# EAGLE design WIMOS-motherboard (EAGLE 7.3.0)
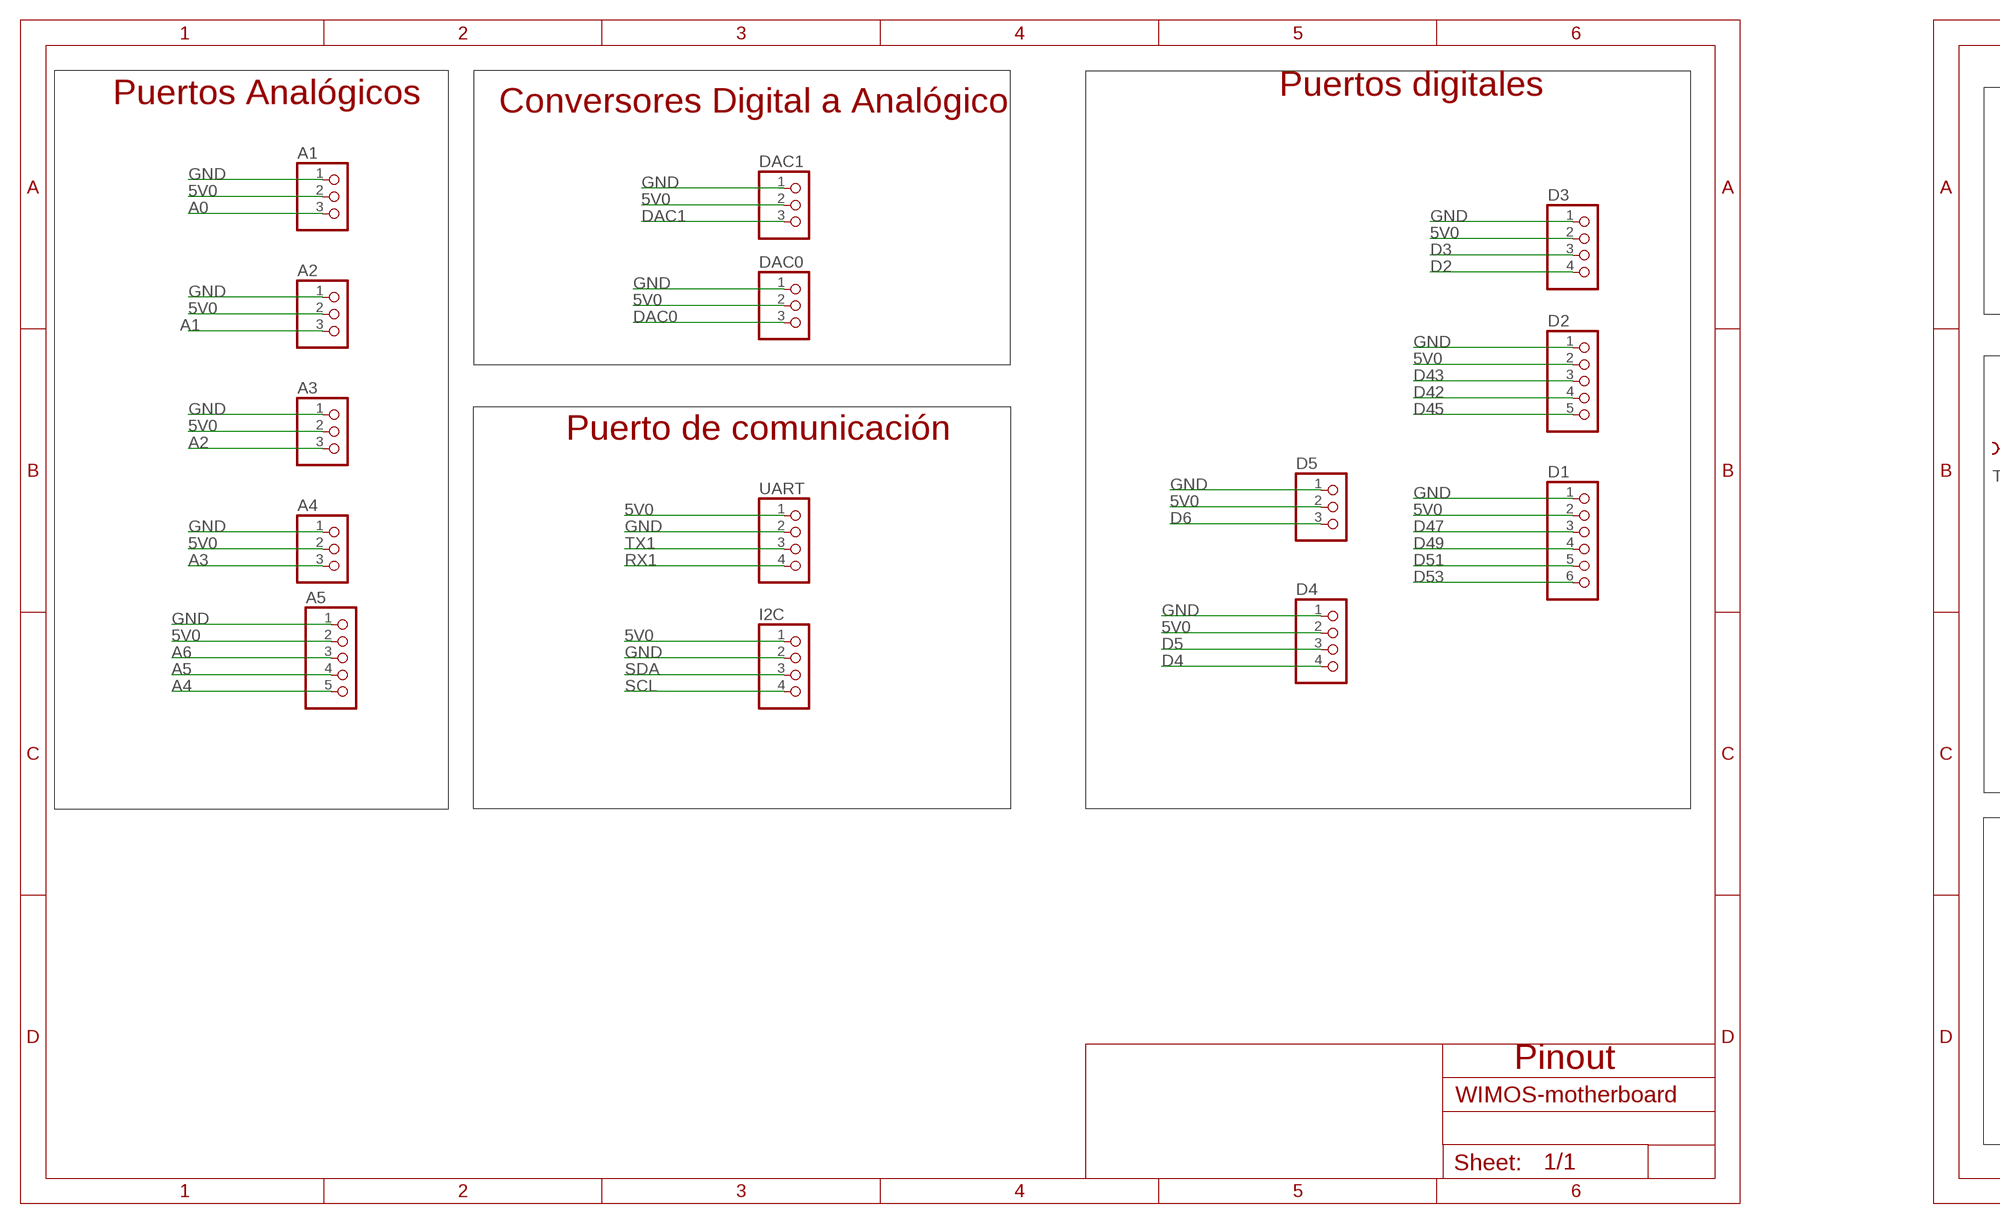
[diagram p0: schematic, sheet 1, part 1 of 2]
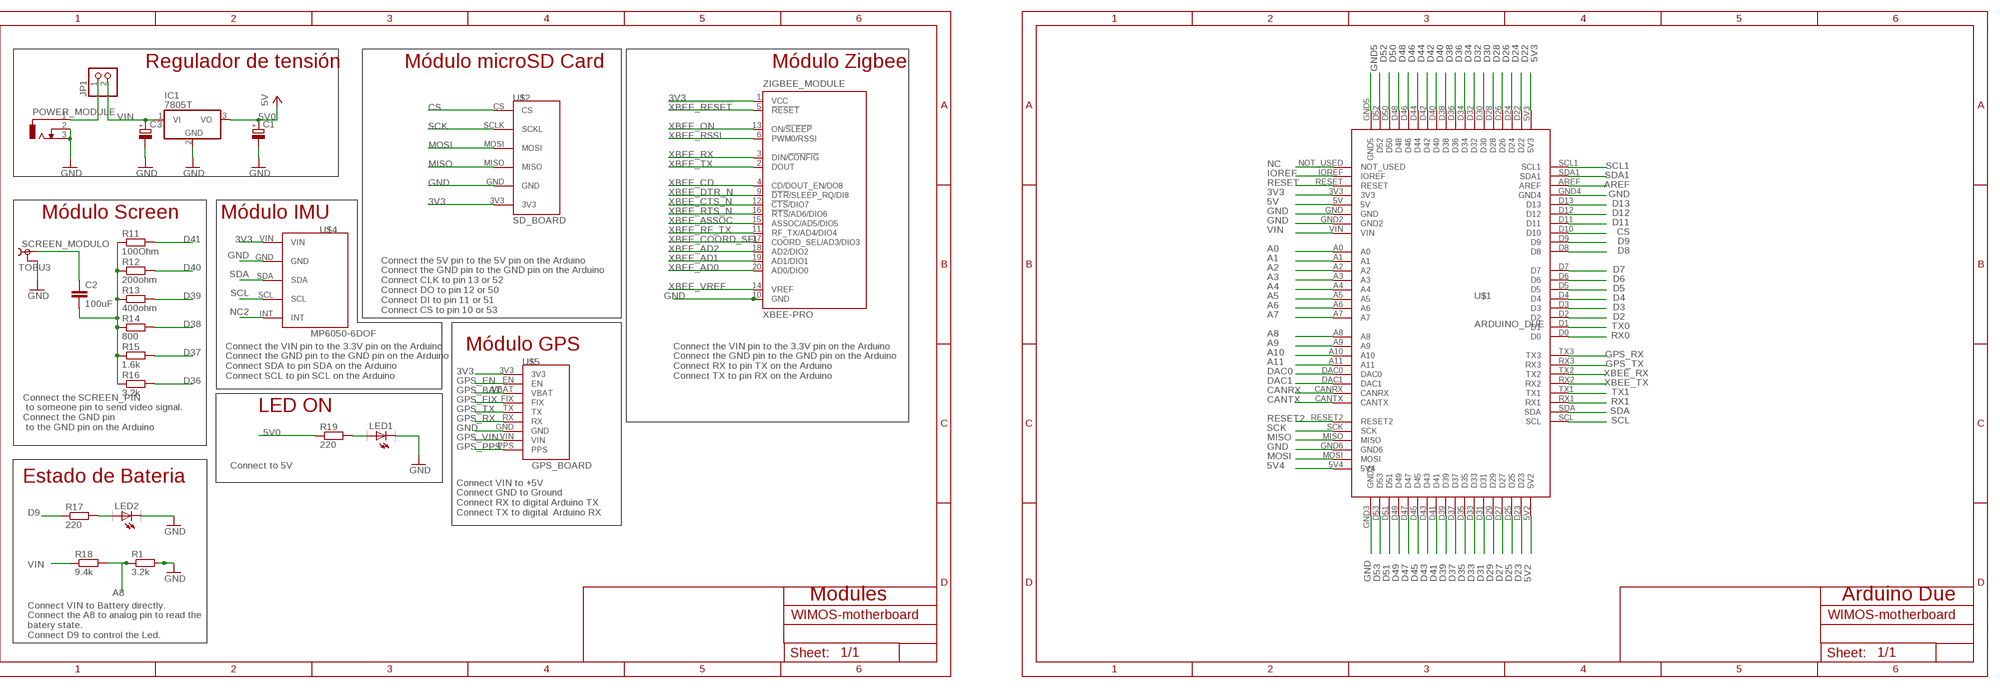
[diagram p1: schematic, sheet 1, part 2 of 2]

## Parts
A1  PINHD-1X3/90  [1X03/90]
A2  PINHD-1X3/90  [1X03/90]
A3  PINHD-1X3/90  [1X03/90]
A4  PINHD-1X3/90  [1X03/90]
A5  PINHD-1X5/90  [1X05/90]
C1  CPOL-EU153CLV-0810  [153CLV-0810]
C2  100uF  C-EU025-025X050  [C025-025X050]
C3  CPOL-EU153CLV-0810  [153CLV-0810]
D1  PINHD-1X6/90  [1X06/90]
D2  PINHD-1X5/90  [1X05/90]
D3  PINHD-1X4/90  [1X04/90]
D4  PINHD-1X4/90  [1X04/90]
D5  PINHD-1X3/90  [1X03/90]
DAC0  PINHD-1X3/90  [1X03/90]
DAC1  PINHD-1X3/90  [1X03/90]
I2C  PINHD-1X4/90  [1X04/90]
IC1  7805T  [TO220H]
JP1  PINHD-1X2  [1X02]
LED1  LED_E  [LED_1206]
LED2  LED_E  [LED_1206]
POWER_MODULE  DCJ0303  [DCJ0303]
R1  3.2k  R-EU_R0805  [R0805]
R11  100Ohm  R-EU_R0805  [R0805]
R12  200ohm  R-EU_R0805  [R0805]
R13  400ohm  R-EU_R0805  [R0805]
R14  800  R-EU_R0805  [R0805]
R15  1.6k  R-EU_R0805  [R0805]
R16  3.2k  R-EU_R0805  [R0805]
R17  220  R-EU_R0805  [R0805]
R18  9.4k  R-EU_R0805  [R0805]
R19  220  R-EU_R0805  [R0805]
SCREEN_MODULO  TOBU3  [TOBU3]
U$1  ARDUINO_DUE  [ARDUINO_DUE]
U$2  SD_BOARD  [SD_BOARD]
U$4  MP6050-6DOF  [MP6050-6DOF]
U$5  GPS_BOARD  [SD_BOARD]
UART  PINHD-1X4/90  [1X04/90]
ZIGBEE_MODULE  XBEE-PRO  [XBEE-PRO]

## Nets
3V3: U$1.3V3 U$2.3V3 U$4.VIN U$5.3V3 ZIGBEE_MODULE.1(VCC)
5V: U$1.5V
5V0: A1.2 A2.2 A3.2 A4.2 A5.2 C1.+ D1.2 D2.2 D3.2 D4.2 D5.2 DAC0.2 DAC1.2 I2C.1 IC1.3(VO) R19.1 UART.1 ; supply symbol labelled 5V
5V2: U$1.5V2
5V3: U$1.5V3
5V4: U$1.5V4
!XBEE_RESET: ZIGBEE_MODULE.5(!RESET)
A0: A1.3 U$1.A0
A1: A2.3 U$1.A1
A2: A3.3 U$1.A2
A3: A4.3 U$1.A3
A4: A5.5 U$1.A4
A5: A5.4 U$1.A5
A6: A5.3 U$1.A6
A7: U$1.A7
A8: R1.1 R18.2 U$1.A8
A9: U$1.A9
A10: U$1.A10
A11: U$1.A11
AREF: U$1.AREF
CANRX: U$1.CANRX
CANTX: U$1.CANTX
CS: U$1.D10 U$2.CS
D2: D3.4 U$1.D2
D3: D3.3 U$1.D3
D4: D4.4 U$1.D4
D5: D4.3 U$1.D5
D6: D5.3 U$1.D6
D7: U$1.D7
D8: U$1.D8
D9: R17.1 U$1.D9
D11: U$1.D11
D12: U$1.D12
D13: U$1.D13
D22: U$1.D22
D23: U$1.D23
D24: U$1.D24
D25: U$1.D25
D26: U$1.D26
D27: U$1.D27
D28: U$1.D28
D29: U$1.D29
D30: U$1.D30
D31: U$1.D31
D32: U$1.D32
D33: U$1.D33
D34: U$1.D34
D35: U$1.D35
D36: R16.2 U$1.D36
D37: R15.2 U$1.D37
D38: R14.2 U$1.D38
D39: R13.2 U$1.D39
D40: R12.2 U$1.D40
D41: R11.2 U$1.D41
D42: D2.4 U$1.D42
D43: D2.3 U$1.D43
D44: U$1.D44
D45: D2.5 U$1.D45
D46: U$1.D46
D47: D1.3 U$1.D47
D48: U$1.D48
D49: D1.4 U$1.D49
D50: U$1.D50
D51: D1.5 U$1.D51
D52: U$1.D52
D53: D1.6 U$1.D53
DAC0: DAC0.3 U$1.DAC0
DAC1: DAC1.3 U$1.DAC1
GND [gnd]: A1.1 A2.1 A3.1 A4.1 A5.1 C1.- C3.- D1.1 D2.1 D3.1 D4.1 D5.1 DAC0.1 DAC1.1 I2C.2 IC1.2(GND) LED1.C LED2.C POWER_MODULE.2 POWER_MODULE.3 R1.2 SCREEN_MODULO.2 SCREEN_MODULO.2@1 SCREEN_MODULO.2@2 U$1.GND U$1.GND2 U$1.GND3 U$1.GND4 U$1.GND6 U$2.GND U$4.GND U$5.GND UART.2 ZIGBEE_MODULE.10(GND)
GND5: U$1.GND5
GPS_BAT: U$5.VBAT
GPS_EN: U$5.EN
GPS_FIX: U$5.FIX
GPS_PPS: U$5.PPS
GPS_RX: U$1.TX3 U$5.RX
GPS_TX: U$1.RX3 U$5.TX
GPS_VIN: U$5.VIN
IOREF: U$1.IOREF
MISO: U$1.MISO U$2.MISO
MOSI: U$1.MOSI U$2.MOSI
N$1: LED1.A R19.2
N$2: C2.1 SCREEN_MODULO.1
N$3: JP1.1 POWER_MODULE.1
N$4: LED2.A R17.2
N$10: C2.2 R11.1 R12.1 R13.1 R14.1 R15.1 R16.1
NC: U$1.NOT_USED
NC2: U$4.INT
RESET: U$1.RESET
RESET2: U$1.RESET2
RX0: U$1.D0
RX1: U$1.RX1 UART.4
SCK: U$1.SCK U$2.SCLK(SCKL)
SCL: I2C.4 U$1.SCL U$4.SCL
SCL1: U$1.SCL1
SDA: I2C.3 U$1.SDA U$4.SDA
SDA1: U$1.SDA1
TX0: U$1.D1
TX1: U$1.TX1 UART.3
VIN: C3.+ IC1.1(VI) JP1.2 R18.1 U$1.VIN
XBEE_AD0: ZIGBEE_MODULE.20(AD0/DIO0)
XBEE_AD1: ZIGBEE_MODULE.19(AD1/DIO1)
XBEE_AD2: ZIGBEE_MODULE.18(AD2/DIO2)
XBEE_ASSOC: ZIGBEE_MODULE.15(ASSOC/AD5/DIO5)
XBEE_CD: ZIGBEE_MODULE.4(CD/DOUT_EN/DO8)
XBEE_COORD_SEL: ZIGBEE_MODULE.17(COORD_SEL/AD3/DIO3)
XBEE_CTS_N: ZIGBEE_MODULE.12(!CTS!/DIO7)
XBEE_DTR_N: ZIGBEE_MODULE.9(!DTR!/SLEEP_RQ/DI8)
XBEE_ON: ZIGBEE_MODULE.13(ON/!SLEEP)
XBEE_RF_TX: ZIGBEE_MODULE.11(RF_TX/AD4/DIO4)
XBEE_RSSI: ZIGBEE_MODULE.6(PWM0/RSSI)
XBEE_RTS_N: ZIGBEE_MODULE.16(!RTS!/AD6/DIO6)
XBEE_RX: U$1.TX2 ZIGBEE_MODULE.3(DIN/!CONFIG)
XBEE_TX: U$1.RX2 ZIGBEE_MODULE.2(DOUT)
XBEE_VREF: ZIGBEE_MODULE.14(VREF)

## Notes on the sheet
- Puertos Analógicos | Puertos digitales
- Conversores Digital a Analógico | Regulador de tensión | Módulo microSD Card | Módulo Zigbee
- Módulo Screen | Módulo IMU
- Puerto de comunicación
- Connect the 5V pin to the 5V pin on the Arduino
  Connect the GND pin to the GND pin on the Arduino
  Connect CLK to pin 13 or 52
  Connect DO to pin 12 or 50
  Connect DI to pin 11 or 51
  Connect CS to pin 10 or 53
- Módulo GPS
- Connect the VIN pin to the 3.3V pin on the Arduino
  Connect the GND pin to the GND pin on the Arduino
  Connect SDA to pin SDA on the Arduino
  Connect SCL to pin SCL on the Arduino
- Connect the VIN pin to the 3.3V pin on the Arduino
  Connect the GND pin to the GND pin on the Arduino
  Connect RX to pin TX on the Arduino
  Connect TX to pin RX on the Arduino
- LED ON
- Connect the SCREEN_PIN
   to someone pin to send video signal.
  Connect the GND pin
   to the GND pin on the Arduino
- Connect to 5V
- Estado de Bateria
- Connect VIN to +5V
  Connect GND to Ground
  Connect RX to digital Arduino TX
  Connect TX to digital  Arduino RX
- Pinout | Modules | Arduino Due
- Connect VIN to Battery directly.
  Connect the A8 to analog pin to read the 
  batery state.
  Connect D9 to control the Led.

## Library data of the parts
A1-A4 D5 DAC0 DAC1 = pinhead:PINHD-1X3: PIN HEADER
A5 D2 = pinhead:PINHD-1X5: PIN HEADER
C1 C3 = rcl:CPOL-EU: POLARIZED CAPACITOR, European symbol
C2 = rcl:C-EU: CAPACITOR, European symbol
D1 = pinhead:PINHD-1X6: PIN HEADER
D3 D4 I2C UART = pinhead:PINHD-1X4: PIN HEADER
IC1 = linear:78*: Positive VOLTAGE REGULATOR Source: http://cache.national.com/ds/LM/LM78L05.pdf http://www.fairchildsemi.com/ds/LM/LM7805.pdf
JP1 = pinhead:PINHD-1X2: PIN HEADER
LED1 LED2 = eagle-ltspice:LED_E: LED Source: http://www.osram.convergy.de Source: www.luxeon.com Source: www.kingbright.com; SPICEMODEL: NONE; SPICEPREFIX: D; SPICETYPE: diode
POWER_MODULE = con-jack:DCJ0303: DC POWER JACK Source: DCJ0303.pdf; OC_FARNELL: unknown; OC_NEWARK: unknown
R1 R11-R19 = rcl:R-EU_: RESISTOR, European symbol
SCREEN_MODULO = con-hirschmann:TOBU3: Female Cinch CONNECTOR ( RCA Jack ); MF: FARNELL; MPN: TOBU 3; OC_FARNELL: 592791; OC_NEWARK: 06WX5914
U$1 = ArduinoDue:ARDUINO_DUE
U$2 = SdBoard:SD_BOARD
U$4 = mp6050:MP6050-6DOF
U$5 = GpsBoard:GPS_BOARD
ZIGBEE_MODULE = maxstream:XBEE: XBee (TM) /XBee-PRO(TM) OEM RF Modules Source: MaxStream, Inc. xbee_productmanual.pdf; MPN: XBP24-AWI-001; OC_FARNELL: 1337916; OC_NEWARK: 42M2667

## Module INPUT
Ports: 

### Library data of the parts

## Net classes
0 default: width 0.203 mm, drill 0.406 mm, clearance 0.203 mm
1 USB: width 0.203 mm, drill 0.406 mm, clearance 0.203 mm
2 gnd: width 0.203 mm, drill 0.406 mm, clearance 0.203 mm
3 usbvcc: width 0.203 mm, drill 0.406 mm, clearance 0.203 mm
4 USBpair: width 0.254 mm, drill 0.406 mm, clearance 0.61 mm

## Board
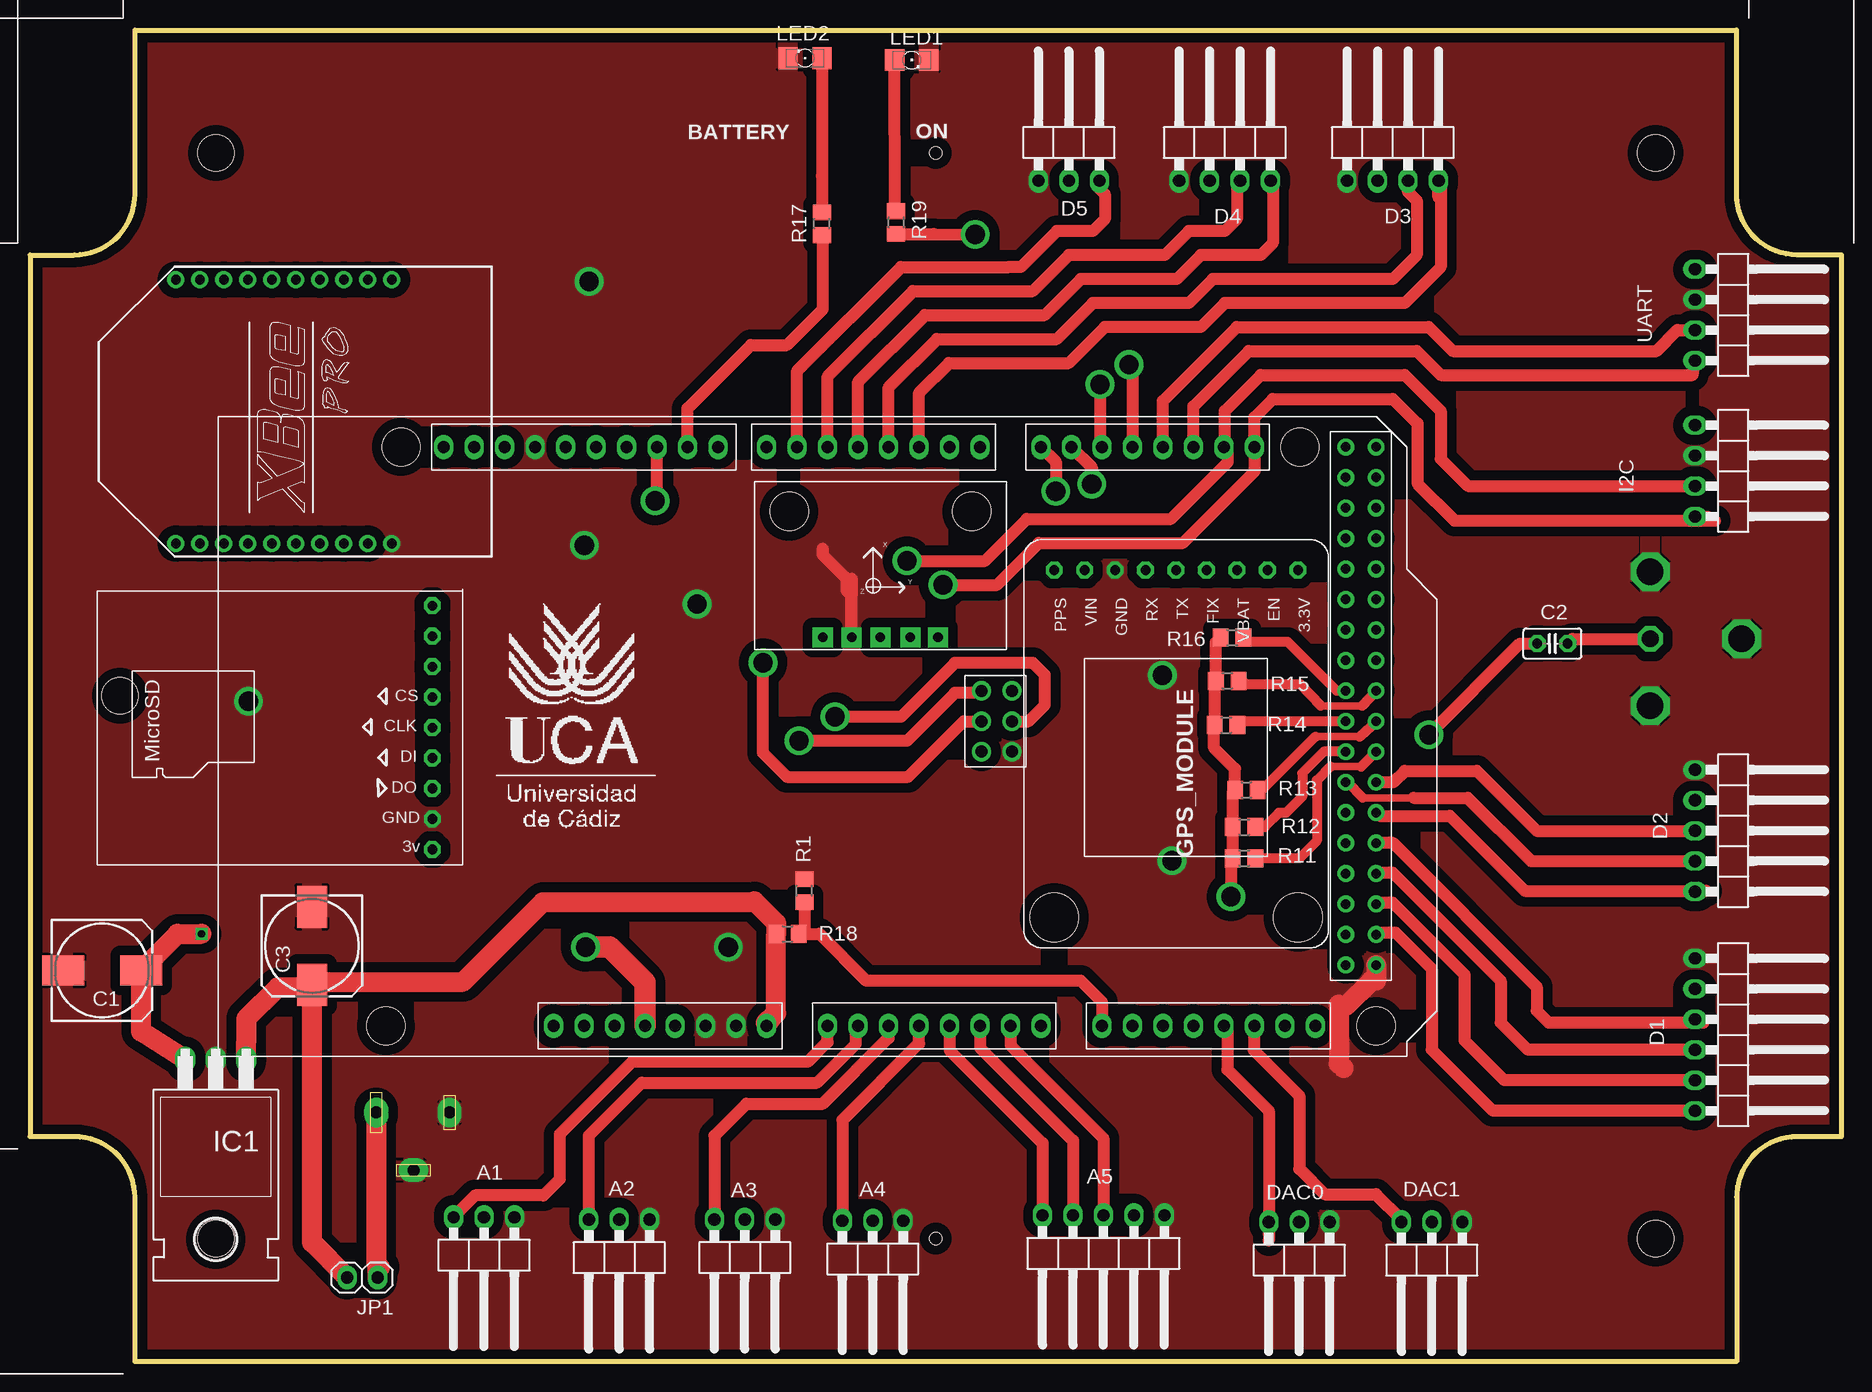
[diagram p2: board, top side]
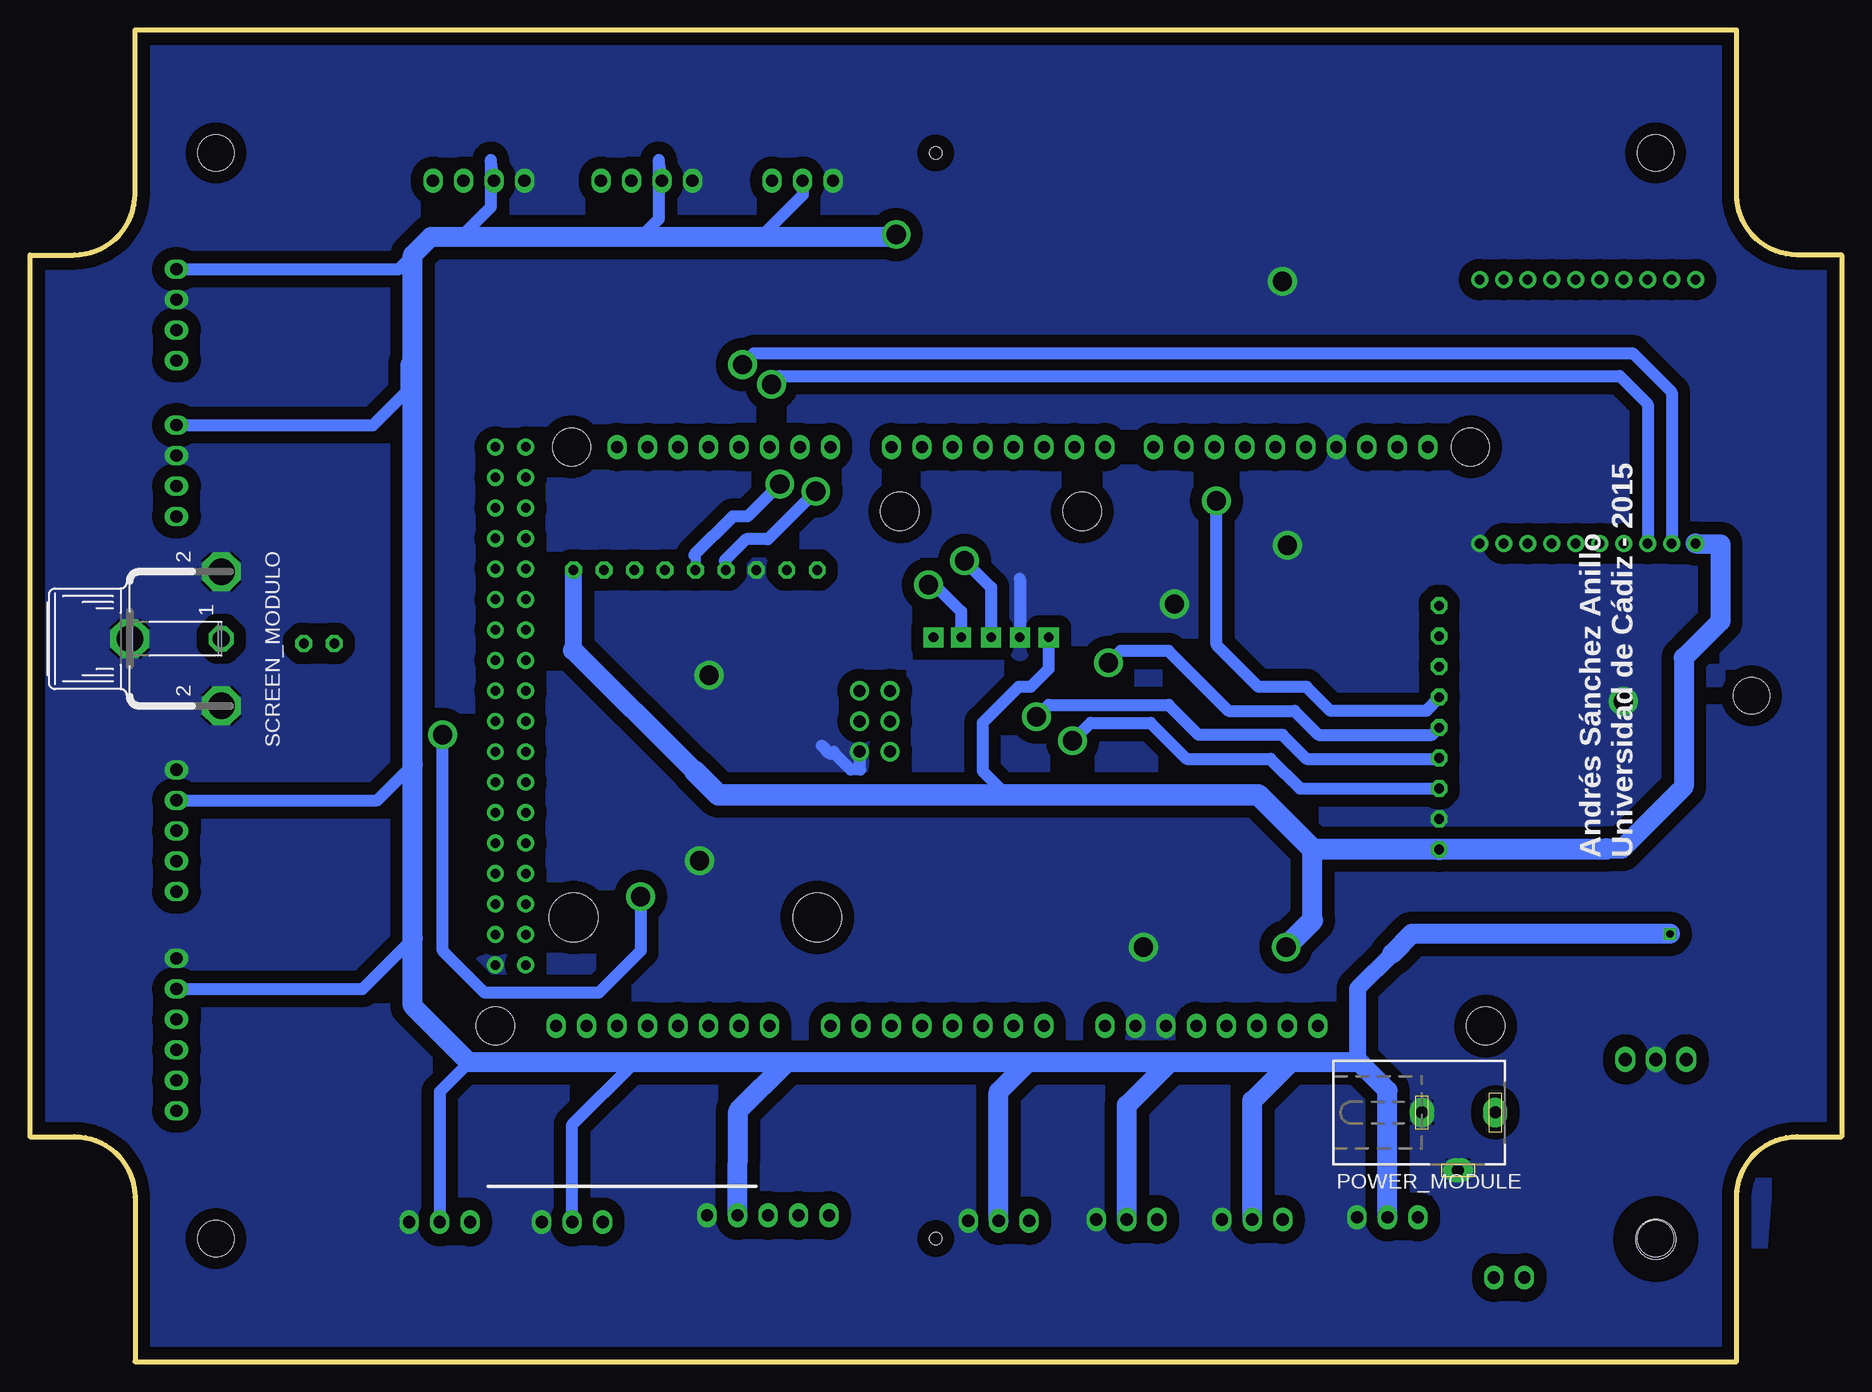
[diagram p3: board, bottom side, seen from below]

Size 151 x 111 mm. Coordinates in mm from the lower left corner, seen from the top.
Outline: 0,92.25 0,18.75 3.69,18.75 arc-90 8.75,13.69 8.75,0 142.25,0 142.25,13.69 arc-90 147.31,18.75 151,18.75 151,92.25 147.31,92.25 arc-90 142.25,97.31 142.25,111 8.75,111 8.75,97.31 arc-90 3.69,92.25 0,92.25
Copper layers (1*16): Top 0.035mm / dielectric 1.6mm / Bottom 0.035mm
Design rules "default *": minimum track width 8mil, minimum drill 16mil, track to track 8mil, track to pad 8mil, pad to pad 8mil, via to via 8mil, smd to smd 6mil, copper to edge 20mil, drill to drill 12mil, minimum pad ring 12mil, minimum via ring 8mil, stop-mask expansion 2mil, vias tented up to drill 25mil, thermal gap 8mil
Holes 3 mm at 7.5,55.5 15.5,100.75 135.5,100.75 15.5,10.25 135.5,10.25
Holes 1 mm at 75.5,100.75 75.5,10.25

### Footprints (pad centres in the part's own frame; a part is rotated, then mirrored left to right if it is on the bottom)
1X03/90 = drill 1.016 long: 1 -2.54,-3.81; 2 0,-3.81; 3 2.54,-3.81
1X05/90 = drill 1.016 long: 1 -5.08,-3.81; 2 -2.54,-3.81; 3 0,-3.81; 4 2.54,-3.81; 5 5.08,-3.81
153CLV-0810 = smd 3.5 x 2.5: + 3.25,0; - -3.25,0
C025-025X050 = drill 0.813 octagon: 1 -1.27,0; 2 1.27,0
1X06/90 = drill 1.016 long: 1 -6.35,-3.81; 2 -3.81,-3.81; 3 -1.27,-3.81; 4 1.27,-3.81; 5 3.81,-3.81; 6 6.35,-3.81
1X04/90 = drill 1.016 long: 1 -3.81,-3.81; 2 -1.27,-3.81; 3 1.27,-3.81; 4 3.81,-3.81
TO220H = drill 1.118 long: 1 -2.54,-10.16; 2 0,-10.16; 3 2.54,-10.16 | hole 3.302: 0,4.826
1X02 = drill 1.016 long: 1 -1.27,0; 2 1.27,0
LED_1206 = smd 1.6 x 1.803: A -1.422,0; C 1.422,0
DCJ0303 = drill 1 pad 2 long: 1 0,3.1; 2 4.8,0; 3 0,-3
R0805 = smd 1.3 x 1.5: 1 -0.95,0; 2 0.95,0
TOBU3 = drill 1.397 octagon: 1 0,-2.54 | drill 2.21 octagon: 2 5.588,-2.54; 2@1 -5.588,-2.54; 2@2 0,5.08
ARDUINO_DUE = drill 1 long: 3V3 -8.89,45.72; 5V -8.89,43.18; A0 -8.89,30.48; A1 -8.89,27.94; A2 -8.89,25.4; A3 -8.89,22.86; A4 -8.89,20.32; A5 -8.89,17.78; A6 -8.89,15.24; A7 -8.89,12.7; A8 -8.89,7.62; A9 -8.89,5.08; A10 -8.89,2.54; A11 -8.89,0; AREF 39.37,57.404; CANRX -8.89,-7.62; CANTX -8.89,-10.16; D0 39.37,17.78; D1 39.37,20.32; D2 39.37,22.86; D3 39.37,25.4; D4 39.37,27.94; D5 39.37,30.48; D6 39.37,33.02; D7 39.37,35.56; D8 39.37,39.624; D9 39.37,42.164; D10 39.37,44.704; D11 39.37,47.244; D12 39.37,49.784; D13 39.37,52.324; DAC0 -8.89,-2.54; DAC1 -8.89,-5.08; GND -8.89,40.64; GND2 -8.89,38.1; GND4 39.37,54.864; IOREF -8.89,50.8; NOT_USED -8.89,53.34; RESET -8.89,48.26; RX1 39.37,0; RX2 39.37,5.08; RX3 39.37,10.16; SCL 39.37,-5.08; SCL1 39.37,62.484; SDA 39.37,-2.54; SDA1 39.37,59.944; TX1 39.37,2.54; TX2 39.37,7.62; TX3 39.37,12.7; VIN -8.89,35.56 | drill 0.8: 5V2 39.37,-15.24; 5V3 39.37,-12.7; D22 36.83,-12.7; D23 36.83,-15.24; D24 34.29,-12.7; D25 34.29,-15.24; D26 31.75,-12.7; D27 31.75,-15.24; D28 29.21,-12.7; D29 29.21,-15.24; D30 26.67,-12.7; D31 26.67,-15.24; D32 24.13,-12.7; D33 24.13,-15.24; D34 21.59,-12.7; D35 21.59,-15.24; D36 19.05,-12.7; D37 19.05,-15.24; D38 16.51,-12.7; D39 16.51,-15.24; D40 13.97,-12.7; D41 13.97,-15.24; D42 11.43,-12.7; D43 11.43,-15.24; D44 8.89,-12.7; D45 8.89,-15.24; D46 6.35,-12.7; D47 6.35,-15.24; D48 3.81,-12.7; D49 3.81,-15.24; D50 1.27,-12.7; D51 1.27,-15.24; D52 -1.27,-12.7; D53 -1.27,-15.24; GND3 -3.81,-15.24; GND5 -3.81,-12.7 | drill 1: 5V4 19.05,15.113; GND6 13.97,15.113; MISO 19.05,17.653; MOSI 16.51,15.113; RESET2 13.97,17.653; SCK 16.51,17.653 | hole 3.175: 39.37,66.04; -8.89,67.31; -8.89,-15.24; 39.37,-8.89
SD_BOARD = drill 0.8 octagon: 3V3 27.94,-21.56; CD 27.94,-6.32; CD1 27.94,-3.78; CD2 27.94,-1.24; CS 27.94,-8.86; GND 27.94,-19.02; MISO 27.94,-16.48; MOSI 27.94,-13.94; SCLK 27.94,-11.4
MP6050-6DOF = drill 0.8 pad 1.676 square: GND 8.1,1; INT 15.3,1; SCL 13,1; SDA 10.5,1; VIN 5.7,1 | hole 3.2: 2.9,11.5; 18.1,11.5
SD_BOARD' = drill 0.8 octagon: 3V3 2.794,22.86; EN 2.794,20.32; FIX 2.794,15.24; GND 2.794,7.62; PPS 2.794,2.54; RX 2.794,10.16; TX 2.794,12.7; VBAT 2.794,17.78; VIN 2.794,5.08 | hole 4.064: 31.75,22.86; 31.75,2.54
XBEE-PRO = drill 0.8 pad 1.27: 1 -11,9; 2 -11,7; 3 -11,5; 4 -11,3; 5 -11,1; 6 -11,-1; 7 -11,-3; 8 -11,-5; 9 -11,-7; 10 -11,-9; 11 11,-9; 12 11,-7; 13 11,-5; 14 11,-3; 15 11,-1; 16 11,1; 17 11,3; 18 11,5; 19 11,7; 20 11,9

### Placement (x,y rotation side)
A1  37.84,8.22 180 top
A2  49.12,8.02 180 top
A3  59.58,8.02 180 top
A4  70.25,7.92 180 top
A5  89.48,8.37 180 top
C1  6,32.6 0 top
C2  126.9,59.85 180 top
C3  23.5,34.65 270 top
D1  142.6,27.25 270 top
D2  142.6,44.25 270 top
D3  113.6,102.25 0 top
D4  99.6,102.25 0 top
D5  86.6,102.25 0 top
DAC0  105.79,7.82 180 top
DAC1  116.85,7.82 180 top
I2C  142.6,74.25 270 top
IC1  15.48,15.02 180 top
JP1  27.7,7 180 top
LED1  73.5,108.5 0 top
LED2  64.6,108.65 180 top
POWER_MODULE  31.96,20.75 270 bottom
R1  64.55,39.25 90 top
R11  101.2,41.95 0 top
R12  101.2,44.55 0 top
R13  101.4,47.65 0 top
R14  99.7,53.05 0 top
R15  99.8,56.75 0 top
R16  100.2,60.35 0 top
R17  66,94.85 90 top
R18  63.15,35.65 0 top
R19  72.2,94.95 90 top
SCREEN_MODULO  137.6,60.25 90 bottom
U$1  96.97,36.86 90 top
U$2  5.6,64.25 0 top
U$4  60.38,59.36 0 top
U$5  GPS_BOARD  [SD_BOARD']  82.84,68.77 270 top
UART  142.6,87.25 270 top
ZIGBEE_MODULE  21.16,79.19 90 top

### Tracks (layer width: path | path; a pad name or v marks a point on that pad's centre or on a via)
3V3  (via drill 1.6 pad 1.68)
  Top 1.778: U$1.3V3 51.25,31.6 48.3,34.55 v46.3,34.55
  Bottom 1.016: 69.6,47.25 71.6,49.25 71.6,53.25 68.6,56.25 67.6,56.25 66.1,57.75 66.1,60.35 U$4.VIN
  Bottom 1.422: 105.75,59.3 105.7,59.35 U$5.3V3
  Bottom 1.676: 94.4,48.05 95.61,49.25 105.75,59.3 | 44.09,36.76 44.09,42.74 | ZIGBEE_MODULE.1 10.1,68.13 10.1,61.7 13.15,58.65 13.15,47.9 18.32,42.73 19.6,42.73
  Bottom 1.778: 19.6,42.73 U$2.3V3 44.09,42.74 48.6,47.25 69.6,47.25 93.61,47.25 95.61,49.25 | v46.3,34.55 44.09,36.76
5V0  (via drill 0.6, 1.6 pad 1.68)
  Top 1.016: R19.1 75.35,94 v78.8,93.95
  Top 1.676: IC1.3 9.25,27.52 C1.+ 12.3,35.65 v14.3,35.65
  Bottom 1.016: 114.4,24.95 116.85,22.5 DAC1.2 | DAC0.2 105.79,19.76 100.6,24.95 | D1.2 123.29,31.06 119.1,35.25 | I2C.1 122.41,78.06 119.6,80.87 119.6,82.25 | 119.6,82.25 119.6,83.25 | D3.2 112.6,100.17 112.6,96.25 115.1,93.75 | D4.2 98.6,100.17 98.6,95.25 100.1,93.75 | D5.2 86.6,97.25 90.1,93.75 90.6,93.75 | 119.1,92.25 119.1,82.75 119.6,82.25 | UART.1 120.29,91.06 117.6,93.75 | D2.2 122.06,46.79 119.1,49.75
  Bottom 1.422: 36.35,35.1 37.45,34 40.35,31.1 40.35,25.1 40.05,24.8
  Bottom 1.676: 45.9,24.95 40.2,24.95 40.05,24.8 37.84,22.59 A1.2 | 45.9,24.95 56,24.95 | 56,24.95 67.8,24.95 | 67.8,24.95 87.9,24.95 | 87.9,24.95 100.6,24.95 114.4,24.95 119.1,29.65 119.1,35.25 119.1,49.75 119.1,92.25 117.6,93.75 115.1,93.75 100.1,93.75 90.6,93.75 79,93.75 v78.8,93.95 | A5.2 91.97,20.88 87.9,24.95 | A4.2 70.25,22.5 67.8,24.95 | A3.2 59.58,21.37 56,24.95 | A2.2 49.12,21.73 45.9,24.95 | v14.3,35.65 35.8,35.65 37.45,34
A0
  Top 1.016: U$1.A0 66.49,26.64 64.85,25 50.2,25 44.15,18.95 44.15,15.2 42.8,13.85 37.1,13.85 35.3,12.05 A1.3
A1
  Top 1.016: U$1.A1 68.85,27.79 68.85,26.5 65.6,23.25 51,23.25 46.58,18.83 A2.3
A2
  Top 1.016: U$1.A2 71.57,26.97 66.1,21.5 59.71,21.5 57.04,18.83 A3.3
A3
  Top 1.016: U$1.A3 74.11,26.51 67.71,20.11 A4.3
A4
  Top 1.016: U$1.A4 76.65,25.95 84.4,18.2 A5.5
A5
  Top 1.016: U$1.A5 79.19,26.16 86.94,18.41 A5.4
A6
  Top 1.016: U$1.A6 81.73,26.37 89.48,18.62 A5.3
A8
  Top 1.016: U$1.A8 89.35,30 87.6,31.75 69.7,31.75 65.8,35.65 R18.2 64.55,36.1 R1.1
CS  (via drill 1.6 pad 1.68)
  Top 1.016: v52.1,71.75 52.27,71.92 U$1.D10
  Bottom 1.016: v52.1,71.75 52.1,59.75 48.6,56.25 44.6,56.25 42.6,54.25 34.6,54.25 33.46,55.39 U$2.CS
D2
  Top 1.016: U$1.D2 74.11,80.76 76.6,83.25 86.6,83.25 89.6,86.25 97.6,86.25 99.6,88.25 114.6,88.25 117.6,91.25 117.6,98.25 D3.4 117.41,97.06
D3
  Top 1.016: U$1.D3 71.57,81.22 75.6,85.25 85.6,85.25 88.6,88.25 96.6,88.25 98.6,90.25 113.6,90.25 115.6,92.25 115.6,96.79 114.87,97.52 D3.3
D4
  Top 1.016: U$1.D4 69.03,81.68 74.6,87.25 84.6,87.25 87.6,90.25 95.6,90.25 97.6,92.25 102.6,92.25 103.6,93.25 103.6,97.87 103.41,98.06 D4.4
D5
  Top 1.016: U$1.D5 66.49,82.14 73.6,89.25 83.6,89.25 86.6,92.25 94.6,92.25 96.6,94.25 99.6,94.25 100.6,95.25 100.6,98.17 D4.3 100.87,98.52
D6
  Top 1.016: U$1.D6 63.95,82.6 72.6,91.25 81.6,91.25 82.6,91.25 85.6,94.25 88.6,94.25 89.6,95.25 89.6,97.33 89.14,97.79 D5.3
D9
  Top 1.016: U$1.D9 54.81,79.46 60.1,84.75 63.1,84.75 66.1,87.75 66.1,93.8 R17.1
D36
  Top 0.813: U$1.D36 108.94,55.91 104.85,60 101.5,60 R16.2
D37
  Top 0.61: 111.05,54.65 107.6,54.65
  Top 0.813: U$1.D37 111.05,54.65 | 107.6,54.65 105.9,56.45 101.4,56.45 101.3,56.55 100.95,56.55 R15.2
D38
  Top 0.813: U$1.D38 100.97,53.37 R14.2
D39
  Top 0.61: 110.84,52.1 107.15,52.1
  Top 0.813: U$1.D39 110.84,52.1 | 107.15,52.1 102.7,47.65 R13.2
D40
  Top 0.813: U$1.D40 107.83,50.83 106.05,49.05 106.05,47.1 104.7,45.75 104.1,45.75 102.9,44.55 R12.2
D41
  Top 0.61: 110.98,49.6 108.4,49.6
  Top 0.813: U$1.D41 110.98,49.6 | 108.4,49.6 107.25,48.45 107.25,43.4 105.8,41.95 R11.2
D42
  Top 0.61: 111.1,47 115.35,47
  Top 0.813: U$1.D42 109.81,48.29 111.1,47
  Top 1.016: D2.4 125.14,41.71 119.85,47 115.35,47
D43
  Top 1.016: U$1.D43 113.64,48.29 114.6,49.25 120.6,49.25 125.6,44.25 D2.3
D45
  Top 1.016: U$1.D45 112.47,45.5 118.35,45.5 124.6,39.25 139.71,39.25 D2.5
D47
  Top 1.016: U$1.D47 113.64,43.21 125.6,31.25 125.6,29.25 126.6,28.25 139.52,28.25 D1.3
D49
  Top 1.016: U$1.D49 112.29,40.75 113.6,40.75 122.6,31.75 122.6,28.25 124.87,25.98 D1.4
D51
  Top 1.016: U$1.D51 112.33,38.25 113.6,38.25 119.6,32.25 119.6,26.75 122.91,23.44 D1.5
D53
  Top 1.016: U$1.D53 112.37,35.75 113.85,35.75 116.85,32.75 116.85,26 121.95,20.9 D1.6
DAC0
  Top 1.016: U$1.DAC0 99.8,27.69 99.8,24.35 103.25,20.9 103.25,10.62 | 103.25,10.62 103.25,10.1 | DAC0.3 103.25,10.62
DAC1
  Top 1.016: U$1.DAC1 102,27.92 102,25.95 105.8,22.15 105.8,16.05 107.9,13.95 112.2,13.95 114.31,11.84 DAC1.3
GND  (via drill 1.6 pad 1.68)
  Top 1.016: U$4.GND 68.48,63.87 | 68.48,65.25 68.48,63.87 | 68.48,63.87 68.1,64.25 68.1,65.25 66.1,67.25 66.1,67.75
  Top 1.676: U$1.GND3 112.21,31.76 112.2,31.75 111.8,31.75 109.7,29.65 109.2,29.65 109.1,29.75 109.1,24.85 109.5,24.45
  Bottom 1.016: 84.02,50.83 84.1,50.75 | U$1.GND6 81.86,49.41 81.8,49.35 82.6,49.35 83.9,50.65 84.3,50.65 85,51.35 | 68.48,65.25 U$4.GND 68.6,60.25
  other vias: 94.4,57.2 18.2,55.05 95.2,41.75 46.6,90.05 55.6,63.15 46.2,68.05 58.2,34.55
  pour Bottom (isolate 1.016): 7.81,-0.7 143.45,-1.05 143.95,17.7 150.95,17.5 151.75,92.7 143.75,93.9 142.8,112.05 7.71,111.9 7.26,93.96 -1.45,92.95 -0.8,17.25 6.41,17.09
  pour Top (isolate 0.813): -0.91,113.31 153.6,113 153.35,-3.1 -2.21,-3.29
GPS_RX  (via drill 1.6 pad 1.68)
  Top 1.016: U$1.TX3 85.5,75.01 v85.5,72.55
  Bottom 0.813: 93.1,66.75 93,66.65 U$5.RX
  Bottom 1.016: v85.5,72.55 89.5,68.55 91.3,68.55 93.1,66.75
GPS_TX  (via drill 1.6 pad 1.68)
  Top 1.016: U$1.RX3 88.5,74.55 v88.5,73.15
  Bottom 0.813: 95.64,67.21 95.54,67.11 U$5.TX
  Bottom 1.016: v88.5,73.15 91.2,70.45 92.4,70.45 95.64,67.21
MISO  (via drill 1.6 pad 1.68)
  Top 1.016: U$1.MISO 79.15,55.75 77.1,55.75 73.1,51.75 v64.1,51.75
  Bottom 1.016: v64.1,51.75 62.6,53.25 57.6,53.25 54.6,50.25 47.6,50.25 45.12,47.77 U$2.MISO
MOSI  (via drill 1.6 pad 1.68)
  Top 1.016: U$1.MOSI 83.22,53.37 84.6,54.75 84.6,57.25 83.6,58.25 77.1,58.25 72.6,53.75 v67.1,53.75
  Bottom 1.016: v67.1,53.75 66.1,54.75 56.1,54.75 53.6,52.25 46.6,52.25 44.6,50.25 33.6,50.25 U$2.MOSI
N$1
  Top 1.016: R19.2 72.1,96 LED1.A
N$2
  Top 1.016: C2.1 128.57,60.25 SCREEN_MODULO.1
N$3
  Top 1.676: POWER_MODULE.1 28.86,8.14 29.15,7.85 28.97,7.67 JP1.1
N$4
  Top 1.016: LED2.A 66,98.83 R17.2
N$10  (via drill 1.6 pad 1.68)
  Top 1.016: R16.1 98.85,59.95 R15.1 98.75,56.65 R14.1 98.7,53 98.7,51.15 100.45,49.4 R13.1 100.25,47.45 R12.1 R11.1 100.1,41.8 v100.1,38.75 | v116.6,52.25 124.2,59.85 C2.2
  Bottom 1.016: v116.6,52.25 116.6,34.25 113.1,30.75 103.6,30.75 100.1,34.25 v100.1,38.75
RX1
  Top 1.016: U$1.RX1 96.97,79.62 101.6,84.25 115.6,84.25 117.6,82.25 138.6,82.25 UART.4
SCK  (via drill 1.6 pad 1.68)
  Top 1.016: v61.1,58.25 61.1,50.75 63.1,48.75 73.19,48.75 77.82,53.37 U$1.SCK
  Bottom 1.016: v61.1,58.25 60.1,59.25 56.1,59.25 51.1,54.25 45.6,54.25 43.6,52.25 34.14,52.25 U$2.SCLK
SCL  (via drill 1.6 pad 1.68)
  Top 0.61: 101.88,76.23 U$1.SCL 102.05,76.2
  Top 1.016: v76.1,64.75 80.6,64.75 84.1,68.25 96.1,68.25 102.1,74.25 102.1,76.19 U$1.SCL 102.05,78.7 103.6,80.25 113.6,80.25 115.65,78.2 115.65,73.2 118.75,70.1 139.8,70.1 | 139.8,70.1 140.45,70.1 | I2C.4 139.8,70.43 139.8,70.1
  Bottom 1.016: U$4.SCL 73.38,62.53 75.6,64.75 v76.1,64.75
SDA  (via drill 1.6 pad 1.68)
  Top 0.61: 99.45,76 99.85,76
  Top 0.813: 99.85,76 99.85,75.8
  Top 1.016: v73.1,66.75 79.6,66.75 83.1,70.25 95.1,70.25 99.85,75 99.85,75.8 99.85,75.9 U$1.SDA 99.6,76.32 99.6,79.25 102.6,82.25 114.6,82.25 117.6,79.25 117.6,75.25 119.87,72.98 I2C.3
  Bottom 1.016: U$4.SDA 70.88,64.53 v73.1,66.75
TX1
  Top 1.016: U$1.TX1 94.43,80.08 100.6,86.25 116.6,86.25 118.6,84.25 135.6,84.25 137.33,85.98 UART.3
VIN
  Top 1.676: U$1.VIN 61.4,27.99 61.4,28.25 | 61.6,28.45 62.2,29.05 R18.1 62.2,36.55 60.38,38.38 60.3,38.3 42.75,38.3 36.1,31.65 23.75,31.65 C3.+ | IC1.1 18.03,26.69 18.03,28.59 20.65,31.2 23.3,31.2 C3.+ | JP1.2 23.5,9.93 C3.+
  Top 1.778: 61.4,28.25 61.6,28.45
XBEE_RX  (via drill 1.6 pad 1.68)
  Top 1.016: v89.2,81.45 89.2,76.39 U$1.TX2
  Bottom 1.016: ZIGBEE_MODULE.3 16.16,79.81 18.5,82.15 88.5,82.15 v89.2,81.45
XBEE_TX  (via drill 1.6 pad 1.68)
  Top 1.016: v91.6,83.1 91.89,82.81 U$1.RX2
  Bottom 1.016: ZIGBEE_MODULE.2 14.16,80.81 17.4,84.05 90.65,84.05 v91.6,83.1

### Text on the board
tPlace: Escala 1:1
bPlace: Andrés Sánchez Anillo / Universidad de Cádiz - 2015
tNames: BATTERY | ON